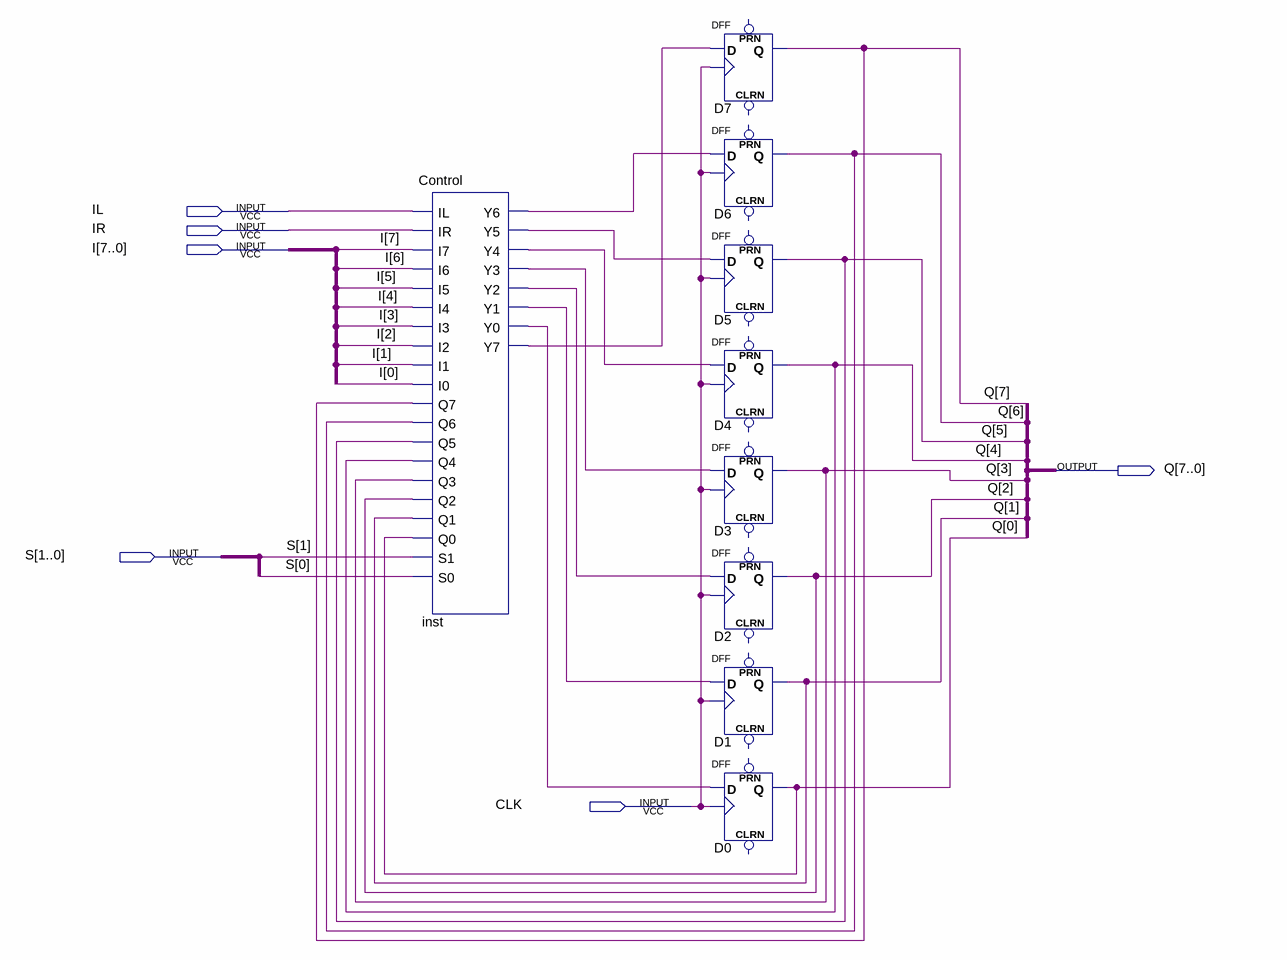
[diagram p0: schematic sheet]
// Quartus schematic SRwPL_8bit.bdf as structural Verilog: 9 symbols, 6 pins
module SRwPL_8bit (
  input  IL,
  input  IR,
  input  [7:0] I,
  input  [1:0] S,
  input  CLK,
  output [7:0] Q
);

  wire inst_y0, inst_y1, inst_y2, inst_y3, inst_y4, inst_y5, inst_y6, inst_y7;

  Control inst (
    .IL(IL), .IR(IR), .I7(I[7]), .I6(I[6]), .I5(I[5]), .I4(I[4]), .I3(I[3]), .I2(I[2]), .I1(I[1]), .I0(I[0]),
    .Q7(Q[7]), .Q6(Q[6]), .Q5(Q[5]), .Q4(Q[4]), .Q3(Q[3]), .Q2(Q[2]), .Q1(Q[1]), .Q0(Q[0]), .S1(S[1]),
    .S0(S[0]), .Y6(inst_y6), .Y5(inst_y5), .Y4(inst_y4), .Y3(inst_y3), .Y2(inst_y2), .Y1(inst_y1),
    .Y0(inst_y0), .Y7(inst_y7));
  DFF D7 (.CLK(CLK), .D(inst_y7), .Q(Q[7]));  // open: CLRN, PRN
  DFF D6 (.CLK(CLK), .D(inst_y6), .Q(Q[6]));  // open: CLRN, PRN
  DFF D5 (.CLK(CLK), .D(inst_y5), .Q(Q[5]));  // open: CLRN, PRN
  DFF D4 (.CLK(CLK), .D(inst_y4), .Q(Q[4]));  // open: CLRN, PRN
  DFF D3 (.CLK(CLK), .D(inst_y3), .Q(Q[3]));  // open: CLRN, PRN
  DFF D2 (.CLK(CLK), .D(inst_y2), .Q(Q[2]));  // open: CLRN, PRN
  DFF D1 (.CLK(CLK), .D(inst_y1), .Q(Q[1]));  // open: CLRN, PRN
  DFF D0 (.CLK(CLK), .D(inst_y0), .Q(Q[0]));  // open: CLRN, PRN
endmodule
